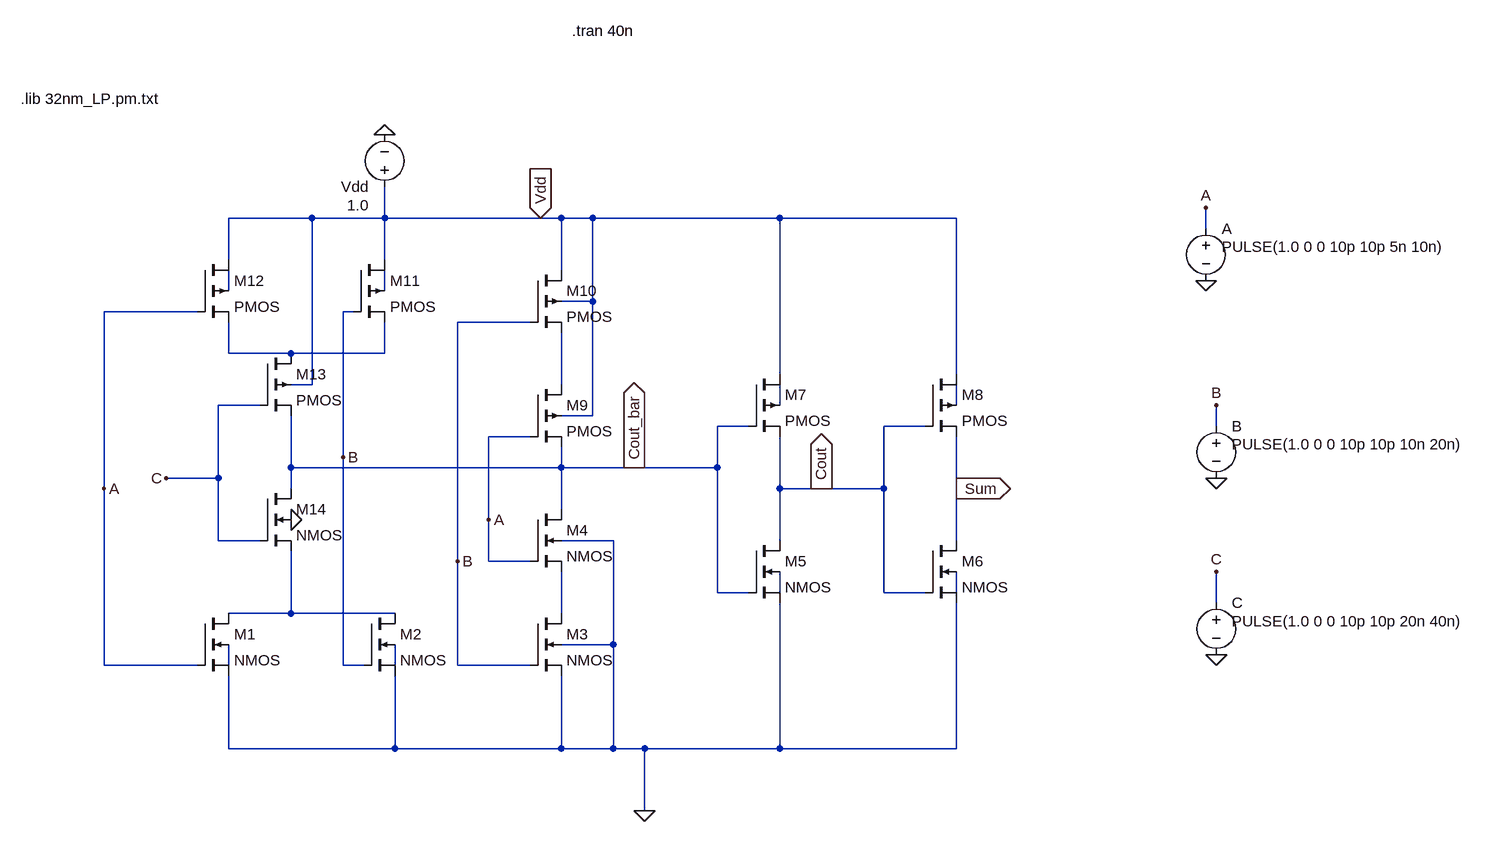
[diagram p0: schematic AMA2_45nm.asc]
AMA2_45nm.asc, the LTspice schematic file:
Version 4
SHEET 1 1044 692
WIRE -752 -240 -880 -240
WIRE -640 -240 -640 -288
WIRE -640 -240 -752 -240
WIRE -400 -240 -640 -240
WIRE -368 -240 -400 -240
WIRE -320 -240 -368 -240
WIRE -32 -240 -320 -240
WIRE 240 -240 -32 -240
WIRE 624 -224 624 -256
WIRE -880 -176 -880 -240
WIRE -640 -176 -640 -240
WIRE -368 -160 -368 -240
WIRE -880 -128 -880 -160
WIRE -640 -128 -640 -160
WIRE -320 -112 -320 -240
WIRE -320 -112 -368 -112
WIRE -928 -96 -1072 -96
WIRE -688 -96 -704 -96
WIRE -416 -80 -528 -80
WIRE -880 -32 -880 -80
WIRE -784 -32 -880 -32
WIRE -640 -32 -640 -80
WIRE -640 -32 -784 -32
WIRE -32 0 -32 -240
WIRE 240 0 240 -240
WIRE -752 16 -752 -240
WIRE -752 16 -784 16
WIRE -368 16 -368 -64
WIRE -832 48 -896 48
WIRE -32 48 -32 16
WIRE 240 48 240 16
WIRE -320 64 -320 -112
WIRE -320 64 -368 64
WIRE -80 80 -128 80
WIRE 192 80 128 80
WIRE 640 80 640 48
WIRE -416 96 -480 96
WIRE -704 128 -704 -96
WIRE -784 144 -784 64
WIRE -368 144 -368 112
WIRE -368 144 -784 144
WIRE -256 144 -368 144
WIRE -128 144 -128 80
WIRE -128 144 -256 144
WIRE -896 160 -896 48
WIRE -896 160 -976 160
WIRE -1072 176 -1072 -96
WIRE -784 176 -784 144
WIRE -32 176 -32 96
WIRE 32 176 -32 176
WIRE 128 176 128 80
WIRE 128 176 32 176
WIRE 240 176 240 96
WIRE -368 208 -368 144
WIRE -480 224 -480 96
WIRE -896 256 -896 160
WIRE -832 256 -896 256
WIRE -288 256 -368 256
WIRE -32 256 -32 176
WIRE 240 256 240 176
WIRE -528 288 -528 -80
WIRE -480 288 -480 224
WIRE -416 288 -480 288
WIRE -128 336 -128 144
WIRE -80 336 -128 336
WIRE -32 336 -32 304
WIRE 128 336 128 176
WIRE 192 336 128 336
WIRE 240 336 240 304
WIRE 640 352 640 304
WIRE -784 368 -784 272
WIRE -784 368 -880 368
WIRE -624 368 -784 368
WIRE -368 368 -368 304
WIRE -288 416 -288 256
WIRE -288 416 -368 416
WIRE -1072 448 -1072 176
WIRE -928 448 -1072 448
WIRE -880 448 -880 416
WIRE -704 448 -704 128
WIRE -672 448 -704 448
WIRE -624 448 -624 416
WIRE -528 448 -528 288
WIRE -416 448 -528 448
WIRE -880 576 -880 464
WIRE -624 576 -624 464
WIRE -624 576 -880 576
WIRE -368 576 -368 464
WIRE -368 576 -624 576
WIRE -288 576 -288 416
WIRE -288 576 -368 576
WIRE -240 576 -288 576
WIRE -32 576 -32 352
WIRE -32 576 -240 576
WIRE 240 576 240 352
WIRE 240 576 -32 576
WIRE -240 672 -240 576
FLAG -240 672 0
FLAG -256 144 Cout_bar
IOPIN -256 144 Out
FLAG 240 176 Sum
IOPIN 240 176 Out
FLAG 624 -144 0
FLAG 640 160 0
FLAG 640 432 0
FLAG 624 -256 A
FLAG 640 48 B
FLAG 640 304 C
FLAG -976 160 C
FLAG -400 -240 Vdd
IOPIN -400 -240 In
FLAG -1072 176 A
FLAG -704 128 B
FLAG -528 288 B
FLAG -480 224 A
FLAG -640 -368 0
FLAG -784 224 0
FLAG 32 176 Cout
IOPIN 32 176 Out
SYMBOL nmos4 -928 368 R0
SYMATTR InstName M1
SYMATTR Value2 l=45n w=1u
SYMBOL nmos4 -672 368 R0
SYMATTR InstName M2
SYMATTR Value2 l=45n w=1u
SYMBOL nmos4 -416 368 R0
SYMATTR InstName M3
SYMATTR Value2 l=45n w=1u
SYMBOL nmos4 -416 208 R0
SYMATTR InstName M4
SYMATTR Value2 l=45n w=1u
SYMBOL nmos4 -80 256 R0
SYMATTR InstName M5
SYMATTR Value2 l=45n w=1u
SYMBOL nmos4 192 256 R0
SYMATTR InstName M6
SYMATTR Value2 l=45n w=1u
SYMBOL pmos4 -80 0 R0
SYMATTR InstName M7
SYMATTR Value2 l=45n w=2u
SYMBOL pmos4 192 0 R0
SYMATTR InstName M8
SYMATTR Value2 l=45n w=2u
SYMBOL pmos4 -416 16 R0
SYMATTR InstName M9
SYMATTR Value2 l=45n w=2u
SYMBOL pmos4 -416 -160 R0
SYMATTR InstName M10
SYMATTR Value2 l=45n w=2u
SYMBOL pmos4 -688 -176 R0
SYMATTR InstName M11
SYMATTR Value2 l=45n w=2u
SYMBOL pmos4 -928 -176 R0
SYMATTR InstName M12
SYMATTR Value2 l=45n w=2u
SYMBOL pmos4 -832 -32 R0
SYMATTR InstName M13
SYMATTR Value2 l=45n w=2u
SYMBOL nmos4 -832 176 R0
SYMATTR InstName M14
SYMATTR Value2 l=45n
SYMBOL voltage 624 -240 R0
WINDOW 3 24 44 Left 2
WINDOW 123 0 0 Left 0
WINDOW 39 0 0 Left 0
SYMATTR Value PULSE(1.0 0 0 10p 10p 5n 10n)
SYMATTR InstName A
SYMBOL voltage 640 64 R0
WINDOW 3 24 44 Left 2
WINDOW 123 0 0 Left 0
WINDOW 39 0 0 Left 0
SYMATTR Value PULSE(1.0 0 0 10p 10p 10n 20n)
SYMATTR InstName B
SYMBOL voltage 640 336 R0
WINDOW 3 24 44 Left 2
WINDOW 123 0 0 Left 0
WINDOW 39 0 0 Left 0
SYMATTR Value PULSE(1.0 0 0 10p 10p 20n 40n)
SYMATTR InstName C
SYMBOL voltage -640 -272 R180
WINDOW 3 24 -12 Left 2
WINDOW 123 0 0 Left 0
WINDOW 39 0 0 Left 0
SYMATTR Value 1.0
SYMATTR InstName Vdd
TEXT -1200 -424 Left 2 !.lib 32nm_LP.pm.txt
TEXT -352 -528 Left 2 !.tran 40n

The netlist it stands for:
* AMA2_45nm.asc
M1 N009 A 0 N011 NMOS l=45n w=1u
M2 N009 B 0 N012 NMOS l=45n w=1u
M3 N010 B 0 0 NMOS l=45n w=1u
M4 Cout_bar A N010 0 NMOS l=45n w=1u
M5 Cout Cout_bar 0 N007 NMOS l=45n w=1u
M6 Sum Cout 0 N008 NMOS l=45n w=1u
M7 Vdd Cout_bar Cout N005 PMOS l=45n w=2u
M8 Vdd Cout Sum N006 PMOS l=45n w=2u
M9 N004 A Cout_bar Vdd PMOS l=45n w=2u
M10 Vdd B N004 Vdd PMOS l=45n w=2u
M11 Vdd B N003 N002 PMOS l=45n w=2u
M12 Vdd A N003 N001 PMOS l=45n w=2u
M13 N003 C Cout_bar Vdd PMOS l=45n w=2u
M14 Cout_bar C N009 0 NMOS l=45n
V§A A 0 PULSE(1.0 0 0 10p 10p 5n 10n)
V§B B 0 PULSE(1.0 0 0 10p 10p 10n 20n)
V§C C 0 PULSE(1.0 0 0 10p 10p 20n 40n)
Vdd Vdd 0 1.0
.model NMOS NMOS
.model PMOS PMOS
.lib standard.mos
.lib 32nm_LP.pm.txt
.tran 40n
.backanno
.end